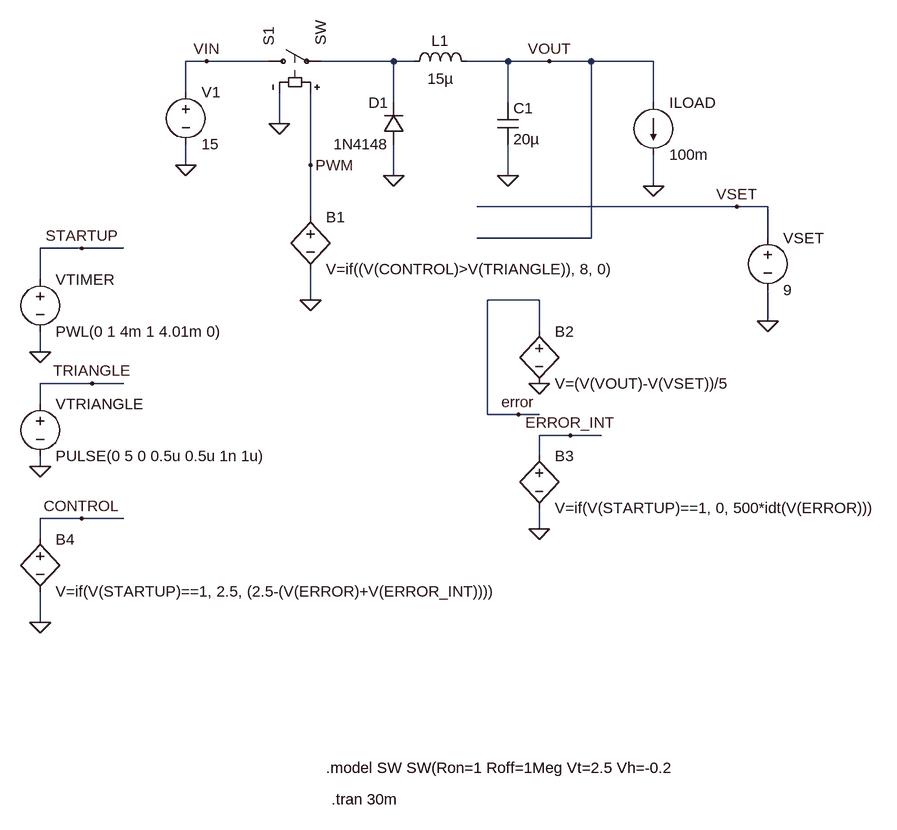
[diagram p0: schematic Closed Loop Buck.asc]
Closed Loop Buck.asc, the LTspice schematic file:
Version 4
SHEET 1 1188 1248
WIRE 112 96 80 96
WIRE 208 96 112 96
WIRE 400 96 288 96
WIRE 432 96 400 96
WIRE 576 96 512 96
WIRE 640 96 576 96
WIRE 704 96 640 96
WIRE 800 96 704 96
WIRE 80 144 80 96
WIRE 400 160 400 96
WIRE 576 160 576 96
WIRE 800 160 800 96
WIRE 224 192 224 144
WIRE 80 256 80 224
WIRE 272 256 272 144
WIRE 400 272 400 224
WIRE 576 272 576 224
WIRE 800 288 800 240
WIRE 928 320 528 320
WIRE 976 320 928 320
WIRE 272 336 272 256
WIRE 704 368 704 96
WIRE 704 368 528 368
WIRE 976 368 976 320
WIRE -80 384 -144 384
WIRE -16 384 -80 384
WIRE -144 432 -144 384
WIRE 272 464 272 416
WIRE 624 464 544 464
WIRE 976 496 976 448
WIRE 624 512 624 464
WIRE -144 544 -144 512
WIRE -64 592 -144 592
WIRE -16 592 -64 592
WIRE -144 624 -144 592
WIRE 544 640 544 464
WIRE 592 640 544 640
WIRE 624 640 592 640
WIRE 672 672 624 672
WIRE 720 672 672 672
WIRE 624 704 624 672
WIRE -144 720 -144 704
WIRE -80 800 -144 800
WIRE -16 800 -80 800
WIRE 624 816 624 784
WIRE -144 832 -144 800
WIRE -144 960 -144 912
FLAG 80 256 0
FLAG 224 192 0
FLAG 272 464 0
FLAG 400 272 0
FLAG 576 272 0
FLAG 800 288 0
FLAG 976 496 0
FLAG 624 592 0
FLAG 624 816 0
FLAG -144 960 0
FLAG -144 720 0
FLAG -144 544 0
FLAG 112 96 VIN
FLAG 272 256 PWM
FLAG 928 320 VSET
FLAG 592 640 error
FLAG 640 96 VOUT
FLAG 672 672 ERROR_INT
FLAG -80 800 CONTROL
FLAG -64 592 TRIANGLE
FLAG -80 384 STARTUP
SYMBOL voltage 80 128 R0
WINDOW 123 0 0 Left 0
WINDOW 39 0 0 Left 0
SYMATTR InstName V1
SYMATTR Value 15
SYMBOL sw 192 96 R270
SYMATTR InstName S1
SYMBOL ind 416 112 R270
WINDOW 0 32 56 VTop 2
WINDOW 3 5 56 VBottom 2
SYMATTR InstName L1
SYMATTR Value 15µ
SYMBOL cap 560 160 R0
SYMATTR InstName C1
SYMATTR Value 20µ
SYMBOL diode 416 224 R180
WINDOW 0 24 64 Left 2
WINDOW 3 24 0 Left 2
SYMATTR InstName D1
SYMATTR Value 1N4148
SYMBOL bv 272 320 R0
SYMATTR InstName B1
SYMATTR Value V=if((V(CONTROL)>V(TRIANGLE)), 8, 0)
SYMBOL bv 624 496 R0
SYMATTR InstName B2
SYMATTR Value V=(V(VOUT)-V(VSET))/5
SYMBOL bv 624 688 R0
SYMATTR InstName B3
SYMATTR Value V=if(V(STARTUP)==1, 0, 500*idt(V(ERROR)))
SYMBOL voltage -144 416 R0
WINDOW 123 0 0 Left 0
WINDOW 39 0 0 Left 0
SYMATTR InstName VTIMER
SYMATTR Value PWL(0 1 4m 1 4.01m 0)
SYMBOL voltage -144 608 R0
WINDOW 123 0 0 Left 0
WINDOW 39 0 0 Left 0
SYMATTR InstName VTRIANGLE
SYMATTR Value PULSE(0 5 0 0.5u 0.5u 1n 1u)
SYMBOL voltage 976 352 R0
WINDOW 123 0 0 Left 0
WINDOW 39 0 0 Left 0
SYMATTR InstName VSET
SYMATTR Value 9
SYMBOL bv -144 816 R0
SYMATTR InstName B4
SYMATTR Value V=if(V(STARTUP)==1, 2.5, (2.5-(V(ERROR)+V(ERROR_INT))))
SYMBOL current 800 160 R0
WINDOW 123 0 0 Left 0
WINDOW 39 0 0 Left 0
SYMATTR InstName ILOAD
SYMATTR Value 100m
TEXT 296 1184 Left 2 !.model SW SW(Ron=1 Roff=1Meg Vt=2.5 Vh=-0.2
TEXT 304 1232 Left 2 !.tran 30m

The netlist it stands for:
* Closed Loop Buck.asc
V1 VIN 0 15
S1 VIN N001 PWM 0 SW
L1 N001 VOUT 15µ
C1 VOUT 0 20µ
D1 0 N001 1N4148
B1 PWM 0 V=if((V(CONTROL)>V(TRIANGLE)), 8, 0)
B2 error 0 V=(V(VOUT)-V(VSET))/5
B3 ERROR_INT 0 V=if(V(STARTUP)==1, 0, 500*idt(V(ERROR)))
VTIMER STARTUP 0 PWL(0 1 4m 1 4.01m 0)
VTRIANGLE TRIANGLE 0 PULSE(0 5 0 0.5u 0.5u 1n 1u)
VSET VSET 0 9
B4 CONTROL 0 V=if(V(STARTUP)==1, 2.5, (2.5-(V(ERROR)+V(ERROR_INT))))
ILOAD VOUT 0 100m
.model D D
.lib standard.dio
.model SW SW(Ron=1 Roff=1Meg Vt=2.5 Vh=-0.2
.tran 30m
.backanno
.end